# Altium project Zenith.PrjPcb
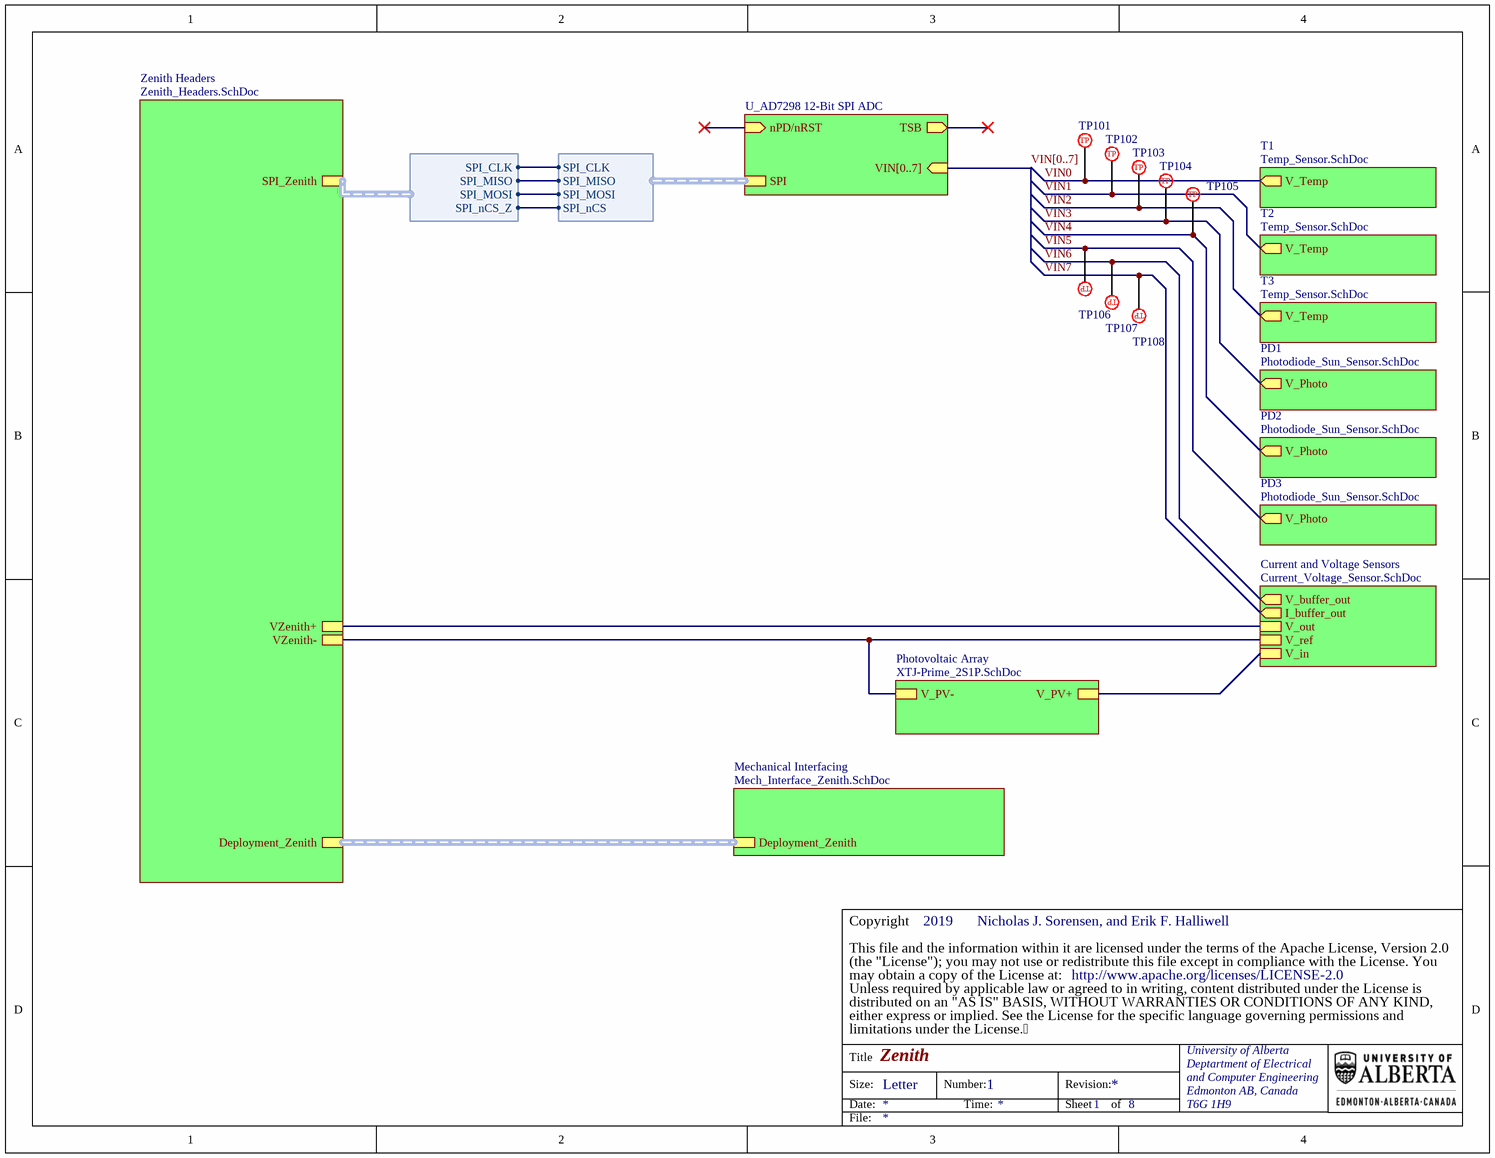
[diagram p0: Zenith.SchDoc]
3 sheets, 16 parts. Net scope: hierarchical (ports join the sheet entries above them; power ports are global).
Board file: Zenith Solar Panel.PcbDoc
Sheets:
  Zenith.SchDoc
    Mechanical Interfacing = Mech_Interface_Zenith.SchDoc
    Zenith Headers = Zenith_Headers.SchDoc

## Sheet Zenith.SchDoc: Zenith
size Letter; Author: Nicholas J. Sorensen, and Erik F. Halliwell; DocumentNumber: 1; SheetNumber: 1; SheetTotal: 8; CopyrightYear: 2019

### Parts
TP101  5017  [KS-5017]  (value not drawn)
TP102  5017  [KS-5017]  (value not drawn)
TP103  5017  [KS-5017]  (value not drawn)
TP104  5017  [KS-5017]  (value not drawn)
TP105  5017  [KS-5017]  (value not drawn)
TP106  5017  [KS-5017]  (value not drawn)
TP107  5017  [KS-5017]  (value not drawn)
TP108  5017  [KS-5017]  (value not drawn)

### Sub-sheets
Current and Voltage Sensors = Current_Voltage_Sensor.SchDoc (file not in this document): V_out, V_ref, V_in, I_buffer_out (out), V_buffer_out (out)
Mechanical Interfacing = Mech_Interface_Zenith.SchDoc: Deployment_Zenith (harness Deployment_Star)
PD1 = Photodiode_Sun_Sensor.SchDoc (file not in this document): V_Photo (out)
PD2 = Photodiode_Sun_Sensor.SchDoc (file not in this document): V_Photo (out)
PD3 = Photodiode_Sun_Sensor.SchDoc (file not in this document): V_Photo (out)
Photovoltaic Array = XTJ-Prime_2S1P.SchDoc (file not in this document): V_PV+, V_PV-
T1 = Temp_Sensor.SchDoc (file not in this document): V_Temp (out)
T2 = Temp_Sensor.SchDoc (file not in this document): V_Temp (out)
T3 = Temp_Sensor.SchDoc (file not in this document): V_Temp (out)
U_AD7298 12-Bit SPI ADC = AD7298 12-Bit SPI ADC.SchDoc (file not in this document): nPD/nRST (in), TSB (out), VIN[0..7] (in), SPI (harness AD7298_SPI)
Zenith Headers = Zenith_Headers.SchDoc: SPI_Zenith (harness SPI_Zenith), VZenith+, Deployment_Zenith (harness Deployment_Star), VZenith-

### Harnesses
AD7298_SPI: SPI_CLK, SPI_MISO, SPI_MOSI, SPI_nCS
SPI_Zenith: SPI_CLK, SPI_MISO, SPI_MOSI, SPI_nCS_Z

### Nets
VZenith+: sheet Current and Voltage Sensors/V_out, sheet Zenith Headers/VZenith+
VZenith-: sheet Photovoltaic Array/V_PV-, sheet Current and Voltage Sensors/V_ref, sheet Zenith Headers/VZenith-
ADC_SPI_nCS_Z: sheet U_AD7298 12-Bit SPI ADC/SPI.SPI_nCS, sheet Zenith Headers/SPI_Zenith.SPI_nCS_Z
SPI_CLK: sheet U_AD7298 12-Bit SPI ADC/SPI.SPI_CLK, sheet Zenith Headers/SPI_Zenith.SPI_CLK
SPI_MISO: sheet U_AD7298 12-Bit SPI ADC/SPI.SPI_MISO, sheet Zenith Headers/SPI_Zenith.SPI_MISO
SPI_MOSI: sheet U_AD7298 12-Bit SPI ADC/SPI.SPI_MOSI, sheet Zenith Headers/SPI_Zenith.SPI_MOSI
VIN0: TP101.1 ; sheet T1/V_Temp
VIN1: TP102.1 ; sheet T2/V_Temp
VIN2: TP103.1 ; sheet T3/V_Temp
VIN3: TP104.1 ; sheet PD1/V_Photo
VIN4: TP105.1 ; sheet PD2/V_Photo
VIN5: TP106.1 ; sheet PD3/V_Photo
VIN6: TP107.1 ; sheet Current and Voltage Sensors/V_buffer_out
VIN7: TP108.1 ; sheet Current and Voltage Sensors/I_buffer_out
(unnamed): sheet Photovoltaic Array/V_PV+, sheet Current and Voltage Sensors/V_in

### Buses and harness runs
bus VIN[0..7] = sheet U_AD7298 12-Bit SPI ADC/VIN[0..7]
harness sheet Mechanical Interfacing/Deployment_Zenith = sheet Zenith Headers/Deployment_Zenith

### Notes on the sheet
- (the "License"); you may not use or redistribute this file except in compliance with the License. You
- This file and the information within it are licensed under the terms of the Apache License, Version 2.0
- Copyright
- Unless required by applicable law or agreed to in writing, content distributed under the License is
- distributed on an "AS IS" BASIS, WITHOUT WARRANTIES OR CONDITIONS OF ANY KIND,
- either express or implied. See the License for the specific language governing permissions and
- limitations under the License.
- may obtain a copy of the License at:
- http://www.apache.org/licenses/LICENSE-2.0
- Title
- Size:
- Date:
- Letter
- Number:
- Time:
- Revision:
- Sheet
- of
- University of Alberta
- Deptartment of Electrical
- and Computer Engineering
- Edmonton AB, Canada
- T6G 1H9
- File:
- (in symbol PTP-KS-00001) TP

### Library data of the parts
TP101-TP108 = PTP-KS-00001: PC TEST POINT MINI SMD; Index: 1; Supplier 1: Digi-key; Supplier 2: Newark; Supplier 3: Mouser; Part Number: PTP-KS-00001; Manufacturer Part Number: 5017; Supplier Part Number 1: 36-5017CT-ND; Publisher: AlbertaSat; Published: 3/15/2016; LatestRevisionDate: 3/15/2016; LatestRevisionNote: ...; PackageReference: KS-5017; PackageDescription: Testpoint Lug Mini SMD 27X10X152; Supplier Link: http://www.digikey.ca/product-detail/en/keystone-electronics/5017/36-5017TR-ND/2217304

## Sheet Mech_Interface_Zenith.SchDoc: Mech_Interface_Zenith
size Letter; Author: Nicholas J. Sorensen, and Erik F. Halliwell; Engineer: Nicholas J. Sorensen, and Erik F. Halliwell; DocumentNumber: 7; SheetNumber: 7; SheetTotal: 8
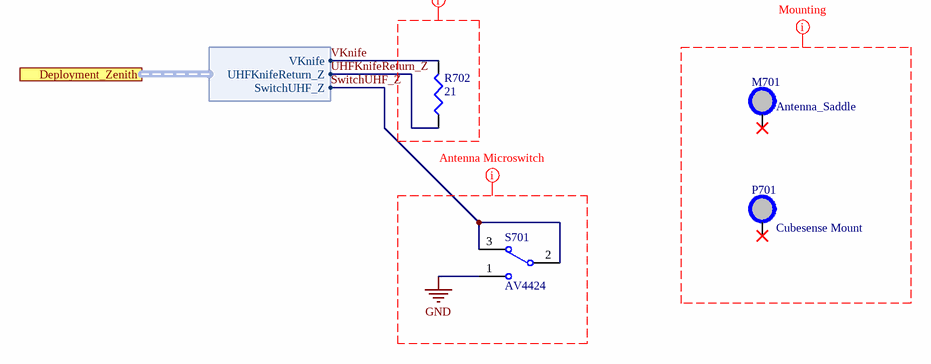
[diagram p1: Mech_Interface_Zenith.SchDoc]

### Parts
M701  Antenna_Saddle  [ANTENNA_SADDLE]
P701  Cubesense Mount  [Cubesense_Mount]
R702  value 21  [VSH-CPF1]  (hidden comment: Res3)
S701  AV4424  [PANA-AV4424]

### Ports
Deployment_Zenith (harness Deployment_Zenith)

### Harnesses
Deployment_Zenith: SwitchUHF_Z, UHFKnifeReturn_Z, VKnife

### Nets
GND: S701.1(NO)
SwitchUHF_Z: S701.2(COM) S701.3(NC) ; port Deployment_Zenith.SwitchUHF_Z
UHFKnifeReturn_Z: R702.1 ; port Deployment_Zenith.UHFKnifeReturn_Z
VKnife: R702.2 ; port Deployment_Zenith.VKnife

Not connected (* = marked no-connect by the designer): M701 1(0)*; P701 1(0)*

### Layout directives
mark named Antenna Burnwire Knife: (no net found under the mark)
mark named Antenna Microswitch: GND
mark named Mounting: (no net found under the mark)

### Notes on the sheet
- (the "License"); you may not use or redistribute this file except in compliance with the License. You
- This file and the information within it are licensed under the terms of the Apache License, Version 2.0
- Copyright
- Unless required by applicable law or agreed to in writing, content distributed under the License is
- distributed on an "AS IS" BASIS, WITHOUT WARRANTIES OR CONDITIONS OF ANY KIND,
- either express or implied. See the License for the specific language governing permissions and
- limitations under the License.
- may obtain a copy of the License at:
- http://www.apache.org/licenses/LICENSE-2.0
- Title
- Size:
- Date:
- Letter
- Number:
- Time:
- Revision:
- Sheet
- of
- University of Alberta
- Deptartment of Electrical
- and Computer Engineering
- Edmonton AB, Canada
- T6G 1H9
- File:

### Library data of the parts
M701 = PXX-ABS-00001: Manufacturer Part Number: Custom; Index: 1; Designator: M?; Part Number: PXX-ABS-00001; Supplier 1: Digi-key; Publisher: AlbertaSat; LatestRevisionNote: ...
P701 = PXX-ABS-00006: Manufacturer Part Number: Custom; Index: 6; Designator: P?; Part Number: PXX-ABS-00006; Supplier 1: Digi-key; Publisher: AlbertaSat; LatestRevisionNote: ...
R702 = PR-VSH-00317: 21 Ohms ±1% 1W Through Hole Resistor Axial Flame Proof, Moisture Resistant, Safety Metal Film; Manufacturer Part Number: CPF121R000FKEE6; Index: 317; Designator: R?; Temperature Coefficient: ±100ppm/°C; Published: 2/27/2020; LatestRevisionDate: 2/27/2020; LatestRevisionNote: ...; PackageReference: VSH-CPF1; Publisher: AlbertaSat; PackageDescription: Chip Resistor; Part Number: PR-VSH-00317; Supplier Part Number 1: CPF21.0CCT-ND; Supplier 1: Digi-key; Supplier Link: #https://www.digikey.ca/product-detail/en/vishay-dale/CPF121R000FKEE6/CPF21.0CCT-ND/2713126#; Tolerance: ±1%; Power - Rated: 1W
S701 = 20035: SWITCH SNAP ACT SPDT 500MA 30V; Part Number: 20035; Manufacturer Part Number: AV4424; Supplier Part Number 1: 255-3743-ND; Supplier 1: Digi-Key; Supplier Link: #https://www.digikey.com/product-detail/en/panasonic-electric-works/AV4424/255-3743-ND/646766#

## Sheet Zenith_Headers.SchDoc: Zenith_Headers
size Letter; Author: Nicholas J. Sorensen, and Erik F. Halliwell; Engineer: Nicholas J. Sorensen, and Erik F. HalliwellNicholas Sorensen, and Erik Halliwell; DocumentNumber: 8; SheetNumber: 8; SheetTotal: 8
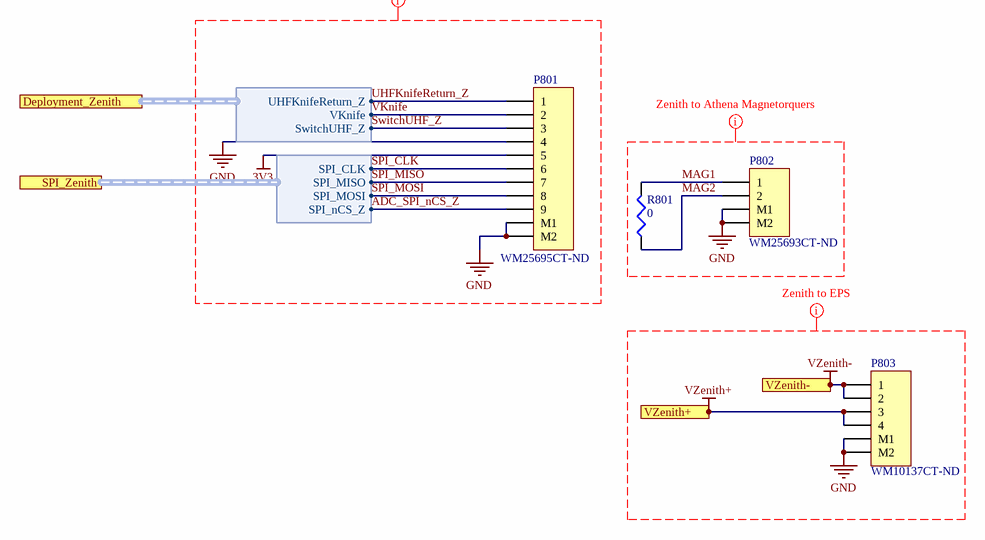
[diagram p2: Zenith_Headers.SchDoc]

### Parts
P801  WM25695CT-ND  [MOLX-5040500991]
P802  WM25693CT-ND  [MOLX-5040500291]
P803  WM10137CT-ND  [MOLX-5040500491]
R801  value 0  [VSH-0805MCU]  (hidden comment: Res3)

### Ports
Deployment_Zenith (harness Deployment_Zenith), SPI_Zenith (harness SPI_Zenith), VZenith+, VZenith-

### Harnesses
Deployment_Zenith: UHFKnifeReturn_Z, VKnife, SwitchUHF_Z
SPI_Zenith: SPI_CLK, SPI_MISO, SPI_MOSI, SPI_nCS_Z

### Nets
3V3: P801.5
GND: P801.4 P801.M1 P801.M2 P802.M1 P802.M2 P803.M1 P803.M2
VZenith+: P803.3 P803.4 ; port VZenith+
VZenith-: P803.1 P803.2 ; port VZenith-
ADC_SPI_nCS_Z: P801.9 ; port SPI_Zenith.SPI_nCS_Z
MAG1: P802.1 R801.2
MAG2: P802.2 R801.1
SPI_CLK: P801.6 ; port SPI_Zenith.SPI_CLK
SPI_MISO: P801.7 ; port SPI_Zenith.SPI_MISO
SPI_MOSI: P801.8 ; port SPI_Zenith.SPI_MOSI
SwitchUHF_Z: P801.3 ; port Deployment_Zenith.SwitchUHF_Z
UHFKnifeReturn_Z: P801.1 ; port Deployment_Zenith.UHFKnifeReturn_Z
VKnife: P801.2 ; port Deployment_Zenith.VKnife

### Layout directives
mark named Zenith to EPS: GND, VZenith+, VZenith-
mark named Zenith to Athena Magnetorquers: GND, MAG1, MAG2
mark named Zenith to Athena Burnwires/SPI: 3V3, ADC_SPI_nCS_Z, GND, SPI_CLK, SPI_MISO, SPI_MOSI, SwitchUHF_Z, UHFKnifeReturn_Z, VKnife

### Notes on the sheet
- (the "License"); you may not use or redistribute this file except in compliance with the License. You
- This file and the information within it are licensed under the terms of the Apache License, Version 2.0
- Copyright
- Unless required by applicable law or agreed to in writing, content distributed under the License is
- distributed on an "AS IS" BASIS, WITHOUT WARRANTIES OR CONDITIONS OF ANY KIND,
- either express or implied. See the License for the specific language governing permissions and
- limitations under the License.
- may obtain a copy of the License at:
- http://www.apache.org/licenses/LICENSE-2.0
- Title
- Size:
- Date:
- Letter
- Number:
- Time:
- Revision:
- Sheet
- of
- University of Alberta
- Deptartment of Electrical
- and Computer Engineering
- Edmonton AB, Canada
- T6G 1H9
- File:

### Library data of the parts
P801 = 68: CONN HEADER SMD R/A 9POS 1.5MM; Part Number: 68; Manufacturer Part Number: 5040500991; Designator: P?; LatestRevisionDate: 17-Jul-2002; LatestRevisionNote: Re-released for DXP Platform.; Publisher: Altium Limited; Supplier Part Number 1: WM25695CT-ND; Supplier 1: Digi-Key; Supplier Link: #https://www.digikey.ca/product-detail/en/molex/5040500991/WM25695CT-ND/9954121#
P802 = 61: CONN HEADER SMD R/A 2POS 1.5MM; Part Number: 61; Manufacturer Part Number: 5040500291; Designator: P?; LatestRevisionDate: 17-Jul-2002; LatestRevisionNote: Re-released for DXP Platform.; Publisher: Altium Limited; Supplier Part Number 1: WM25693CT-ND; Supplier 1: Digi-Key; Supplier Link: #https://www.digikey.ca/product-detail/en/molex/5040500291/WM25693CT-ND/9954119#
P803 = 63: CONN HEADER SMD R/A 4POS 1.5MM; Part Number: 63; Manufacturer Part Number: 5040500491; Designator: P?; LatestRevisionDate: 17-Jul-2002; LatestRevisionNote: Re-released for DXP Platform.; Publisher: Altium Limited; Supplier Part Number 1: WM10137CT-ND; Supplier 1: Digi-Key; Supplier Link: #https://www.digikey.ca/product-detail/en/molex/5040500491/WM10137CT-ND/4357653#
R801 = PR-VSH-00003: RES SMD 0.0 OHM JUMPER 1/5W 0805; Manufacturer Part Number: MCU08050Z0000ZP500; Index: 3; Designator: R?; Published: 3/14/2016; LatestRevisionDate: 3/14/2016; LatestRevisionNote: ...; PackageReference: 0805 (2012 Metric); Publisher: AlbertaSat; PackageDescription: Chip Resistor, 2-Leads, Body 2.00x1.25mm, IPC Low Density; Part Number: PR-VSH-00003; Supplier Part Number 1: MCU0805-0.0-ZZCT-ND; Supplier 1: Digi-key; Supplier Link: http://www.digikey.ca/product-search/en?keywords=MCU0805-0.0-ZZCT-ND; Tolerance: Jumper; Power - Rated: 1/5W; Temperature Coefficient: -; Applications: General Purpose

## Nets that join several sheets
GND: Mech_Interface_Zenith (S701.1), Zenith_Headers (7 pins)
SwitchUHF_Z: Mech_Interface_Zenith (S701.2 S701.3), Zenith_Headers (P801.3)
UHFKnifeReturn_Z: Mech_Interface_Zenith (R702.1), Zenith_Headers (P801.1)
VKnife: Mech_Interface_Zenith (R702.2), Zenith_Headers (P801.2)